# Altium project DH_7LED_LeMinhThu.PrjPcb
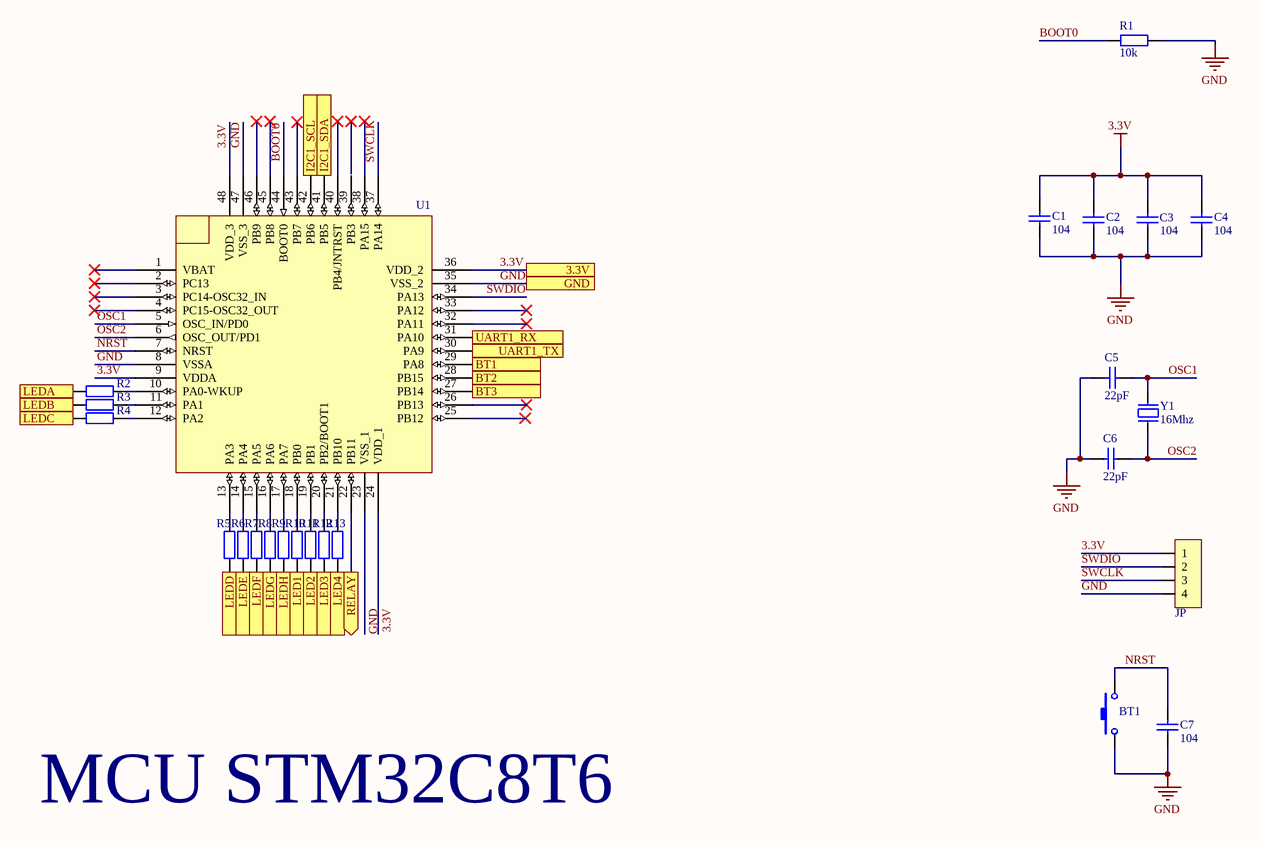
[diagram p0: SCH_DH_7LED.SchDoc]
10 sheets, 75 parts. Net scope: flat (ports and power ports of the same name join across sheets).
Board file: PCB_DH_7LED.PcbDoc
Sheets:
  SCH_DH_7LED.SchDoc
  SCH_LED_7_SEG.SchDoc
  SCH_DS3231.SchDoc
  SCH_BUTTON.SchDoc
  SCH_RELAY.SchDoc
  SCH_IR.SchDoc
  SCH_ESP8266.SchDoc
  SCH_POWER.SchDoc
  SCH_SPEAKER.SchDoc
  SCH_DHT11.SchDoc

## Sheet SCH_DH_7LED.SchDoc
size A3; SheetNumber: 1; SheetTotal: 10

### Parts
BT1  Nut Nhan 2 Chan SMD 3x6x2.5  [Nut Nhan 2 Chan SMD 3x6x2.5]  (value not drawn)
C1  104  [tu 0805]
C2  104  [tu 0805]
C3  104  [tu 0805]
C4  104  [tu 0805]
C5  22pF  [tu 0805]
C6  22pF  [tu 0805]
C7  104  [tu 0805]
JP1  JP  [JP 1x4 DT]
R1  10k  [tro smd 0805]
R2  (no value)  [tro smd 0603]
R3  (no value)  [tro smd 0603]
R4  (no value)  [tro smd 0603]
R5  (no value)  [tro smd 0603]
R6  (no value)  [tro smd 0603]
R7  (no value)  [tro smd 0603]
R8  (no value)  [tro smd 0603]
R9  (no value)  [tro smd 0603]
R10  (no value)  [tro smd 0603]
R11  (no value)  [tro smd 0603]
R12  (no value)  [tro smd 0603]
R13  (no value)  [tro smd 0603]
U1  (no value)  [STM32_LQPF48]
Y1  16Mhz  [Thach Anh 2 chan SMD]

### Ports
3.3V, BT1 (in), BT2 (in), BT3 (in), GND, I2C1_SCL, I2C1_SDA, LED1 (out), LED2 (out), LED3 (out), LED4 (out), LEDA (out), LEDB (out), LEDC (out), LEDD (out), LEDE (out), LEDF (out), LEDG (out), LEDH (out), RELAY (out), UART1_RX, UART1_TX

### Nets
3.3V: C1.1 C2.1 C3.1 C4.1 JP1.1 U1.9(VDDA) U1.24(VDD_1) U1.36(VDD_2) U1.48(VDD_3) ; port 3.3V
GND: BT1.1 C1.2 C2.2 C3.2 C4.2 C5.2 C6.1 C7.2 JP1.4 R1.1 U1.8(VSSA) U1.23(VSS_1) U1.35(VSS_2) U1.47(VSS_3) ; port GND
BOOT0: R1.2 U1.44(BOOT0)
LEDA: R2.2 ; port LEDA
LEDB: R3.2 ; port LEDB
LEDC: R4.2 ; port LEDC
LEDD: R5.1 ; port LEDD
LEDE: R6.1 ; port LEDE
LEDF: R7.1 ; port LEDF
LEDG: R8.1 ; port LEDG
LEDH: R9.1 ; port LEDH
NRST: BT1.2 C7.1 U1.7(NRST)
OSC1: C5.1 U1.5(OSC_IN/PD0) Y1.2
OSC2: C6.2 U1.6(OSC_OUT/PD1) Y1.1
SWCLK: JP1.3 U1.37(PA14)
SWDIO: JP1.2 U1.34(PA13)
NetBT3_1: U1.29(PA8) ; port BT1
NetBT4_1: U1.28(PB15) ; port BT2
NetBT5_1: U1.27(PB14) ; port BT3
NetMD1_1: U1.30(PA9) ; port UART1_TX
NetMD1_8: U1.31(PA10) ; port UART1_RX
NetR2_1: R2.1 U1.10(PA0-WKUP)
NetR3_1: R3.1 U1.11(PA1)
NetR4_1: R4.1 U1.12(PA2)
NetR5_2: R5.2 U1.13(PA3)
NetR6_2: R6.2 U1.14(PA4)
NetR7_2: R7.2 U1.15(PA5)
NetR8_2: R8.2 U1.16(PA6)
NetR9_2: R9.2 U1.17(PA7)
NetR10_1: R10.1 ; port LED1
NetR10_2: R10.2 U1.18(PB0)
NetR11_1: R11.1 ; port LED2
NetR11_2: R11.2 U1.19(PB1)
NetR12_1: R12.1 ; port LED3
NetR12_2: R12.2 U1.20(PB2/BOOT1)
NetR13_1: R13.1 ; port LED4
NetR13_2: R13.2 U1.21(PB10)
NetR20_2: U1.42(PB6) ; port I2C1_SCL
NetR21_1: U1.41(PB5) ; port I2C1_SDA
NetR25_1: U1.22(PB11) ; port RELAY

Not connected (* = marked no-connect by the designer): U1 1(VBAT)* 2(PC13)* 3(PC14-OSC32_IN)* 4(PC15-OSC32_OUT)* 25(PB12)* 26(PB13)* 32(PA11)* 33(PA12)* 38(PA15)* 39(PB3) 40(PB4/JNTRST)* 43(PB7)* 45(PB8)* 46(PB9)*

### Notes on the sheet
- MCU STM32C8T6

### Library data of the parts
BT1 = Nut Nhan 2 Chan SMD 3x6x2.5: Ma_Hang: MH001036; Ten: Nút Nhấn 2 Chân 3x6x2.5MM SMD
C1-C4 C7 = Tu 0805 104 50V 10%: Dán; Don_Vi: Con; So_Chan: 2; Ten_Linh_Kien: Tụ 0805 104-100nF 10% 50V; Ma_Hang: MH004551; Chung_Loai: Dán; Kieu_Chan: *
C5 C6 = Tu 0805 22pF 50V 10%: Dán; Don_Vi: Con; So_Chan: 2; Ten_Linh_Kien: Tụ 0805 22P 10% 50V; Ma_Hang: MH004560; Chung_Loai: Dán; Kieu_Chan: *
JP1 = JP 1x4 2.54 Duc Thang: Cắm; Ten_Linh_Kien: Jump Đơn Đực 2.54MM 1x40P Thẳng 11MM; Don_Vi: Con; Ma_Hang: MH000903; Ghi_Chu: *; Kieu_Chan: *; Chung_Loai: Cắm
R1 = Tro 0805 5% 10k: Dán; Don_Vi: Con; So_Chan: 2; Ten_Linh_Kien: Trở 0805 5% 10k; Ma_Hang: MH005239; Chung_Loai: Dán; Kieu_Chan: *
R2-R13 = Tro 0603 5% 100R: Dán; Don_Vi: Con; So_Chan: 2; Ten_Linh_Kien: Trở 0603 5% 100R; Ma_Hang: MH006315; Chung_Loai: Dán; Kieu_Chan: *
U1 = STM32F103xx_LQFP48: Published: 30-May-2008; DatasheetVersion: rev6, Mar-2008; PackageVersion: Mar-2008; PackageReference: LQFP48; Publisher: Altium Limited; PackageDescription: 48-Pin Low-Profile Quad Flat Pack, 7 x 7 mm Body, 0.5 mm Pitch (LQFP48); ComponentLink1Description: Manufacturer Link; ComponentLink1URL: www.st.com/stm32; ComponentLink2Description: Datasheet; ComponentLink2URL: http://www.st.com/stonline/products/literature/ds/13587.pdf
Y1 = Thach Anh 2 chan SMD: Crystal For all Crystal 2pin.; Value: 4Mhz

## Sheet SCH_LED_7_SEG.SchDoc
size A3; SheetNumber: 2; SheetTotal: 10
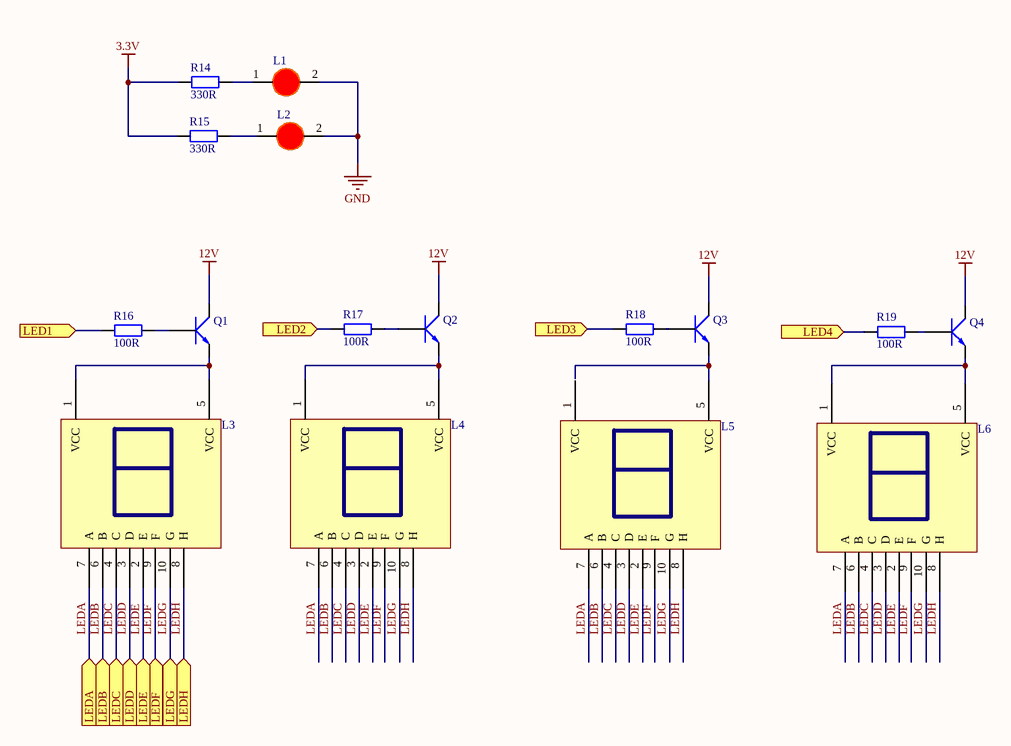
[diagram p1: SCH_LED_7_SEG.SchDoc]

### Parts
L1  (no value)  [LED-3MM-RED]
L2  (no value)  [LED-3MM-RED]
L3  (no value)  [LED7SEG_2.3inch]
L4  (no value)  [LED7SEG_2.3inch]
L5  (no value)  [LED7SEG_2.3inch]
L6  (no value)  [LED7SEG_2.3inch]
Q1  (no value)  [SOT23]
Q2  (no value)  [SOT23]
Q3  (no value)  [SOT23]
Q4  (no value)  [SOT23]
R14  330R  [tro smd 0603]
R15  330R  [tro smd 0603]
R16  100R  [tro smd 0805]
R17  100R  [tro smd 0805]
R18  100R  [tro smd 0805]
R19  100R  [tro smd 0805]

### Ports
LED1 (in), LED2 (in), LED3 (in), LED4 (in), LEDA (in), LEDB (in), LEDC (in), LEDD (in), LEDE (in), LEDF (in), LEDG (in), LEDH (in)

### Nets
3.3V: R14.1 R15.1
12V: Q1.3(C) Q2.3(C) Q3.3(C) Q4.3(C)
GND: L1.2(K) L2.2(K)
LEDA: L3.7(A) L4.7(A) L5.7(A) L6.7(A) ; port LEDA
LEDB: L3.6(B) L4.6(B) L5.6(B) L6.6(B) ; port LEDB
LEDC: L3.4(C) L4.4(C) L5.4(C) L6.4(C) ; port LEDC
LEDD: L3.3(D) L4.3(D) L5.3(D) L6.3(D) ; port LEDD
LEDE: L3.2(E) L4.2(E) L5.2(E) L6.2(E) ; port LEDE
LEDF: L3.9(F) L4.9(F) L5.9(F) L6.9(F) ; port LEDF
LEDG: L3.10(G) L4.10(G) L5.10(G) L6.10(G) ; port LEDG
LEDH: L3.8(H) L4.8(H) L5.8(H) L6.8(H) ; port LEDH
NetL1_1: L1.1(A) R14.2
NetL2_1: L2.1(A) R15.2
NetL3_1: L3.1(VCC) L3.5(VCC) Q1.2(E)
NetL4_1: L4.1(VCC) L4.5(VCC) Q2.2(E)
NetL5_5: L5.5(VCC) Q3.2(E)
NetL6_1: L6.1(VCC) L6.5(VCC) Q4.2(E)
NetQ1_1: Q1.1(B) R16.2
NetQ2_1: Q2.1(B) R17.2
NetQ3_1: Q3.1(B) R18.2
NetQ4_1: Q4.1(B) R19.2
NetR10_1: R16.1 ; port LED1
NetR11_1: R17.1 ; port LED2
NetR12_1: R18.1 ; port LED3
NetR13_1: R19.1 ; port LED4

Not connected (* = marked no-connect by the designer): L5 1(VCC)

### Library data of the parts
L1 L2 = LED 3mm Do: Cắm; Don_Vi: Con; Ma_Hang: MH003892; Ten_Linh_Kien: Led 3MM Phủ Đỏ (10c); Ghi_Chu: *; Kieu_Chan: *; Chung_Loai: Cắm
L3-L6 = LED 7x1 2.3inch Anot: Dán; Don_Vi: Con; Ma_Hang: MH000901; Ten_Linh_Kien: Led 7 2.3 1 Số Anot (Sáng Đỏ); Ghi_Chu: *; Kieu_Chan: *; Chung_Loai: Dán
Q1-Q4 = C1815 HF SMD: NPN transistor; Value: C9014
R14 R15 = Tro 0603 5% 330R: Dán; Don_Vi: Con; Ma_Hang: MH006910; So_Chan: 2; Ten_Linh_Kien: Trở 0603 5% 330R; Chung_Loai: Dán; Kieu_Chan: *
R16-R19 = Tro 0805 5% 100R: Dán; Don_Vi: Con; So_Chan: 2; Ten_Linh_Kien: Trở 0805 5% 100R; Ma_Hang: MH005251; Chung_Loai: Dán; Kieu_Chan: *

## Sheet SCH_DS3231.SchDoc
size A3; SheetNumber: 3; SheetTotal: 10
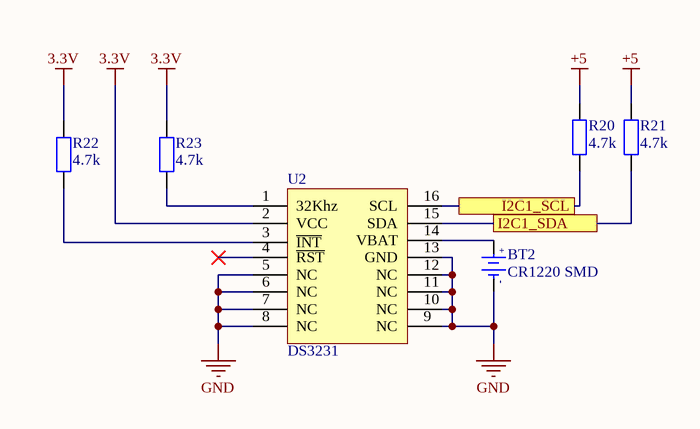
[diagram p2: SCH_DS3231.SchDoc]

### Parts
BT2  CR1220 SMD  [DE PIN CR1220]
R20  4.7k  [tro smd 0805]
R21  4.7k  [tro smd 0805]
R22  4.7k  [tro smd 0805]
R23  4.7k  [tro smd 0805]
U2  DS3231  [SOIC 16]

### Ports
I2C1_SCL, I2C1_SDA

### Nets
3.3V: R22.1 R23.2 U2.2(VCC)
+5: R20.1 R21.2
GND: BT2.2(GND) U2.5(NC) U2.6(NC) U2.7(NC) U2.8(NC) U2.9(NC) U2.10(NC) U2.11(NC) U2.12(NC) U2.13(GND)
NetBT2_1: BT2.1(+3V) U2.14(VBAT)
NetR20_2: R20.2 U2.16(SCL) ; port I2C1_SCL
NetR21_1: R21.1 U2.15(SDA) ; port I2C1_SDA
NetR22_2: R22.2 U2.3(~{INT})
NetR23_1: R23.1 U2.1(32Khz)

Not connected (* = marked no-connect by the designer): U2 4(~{RST})*

### Notes on the sheet
- (in symbol De pin CR1220 SMD) +; -

### Library data of the parts
BT2 = De pin CR1220 SMD: Ten: Đế PIN CR1220 SMD; Ma_Hang: MH000833
R20-R23 = Tro 0805 5% 4.7k: Dán; Don_Vi: Con; So_Chan: 2; Ten_Linh_Kien: Trở 0805 5% 4.7k; Ma_Hang: MH005307; Chung_Loai: Dán; Kieu_Chan: *
U2 = DS3231 SMD: SOIC

## Sheet SCH_BUTTON.SchDoc
size A3; SheetNumber: 4; SheetTotal: 10
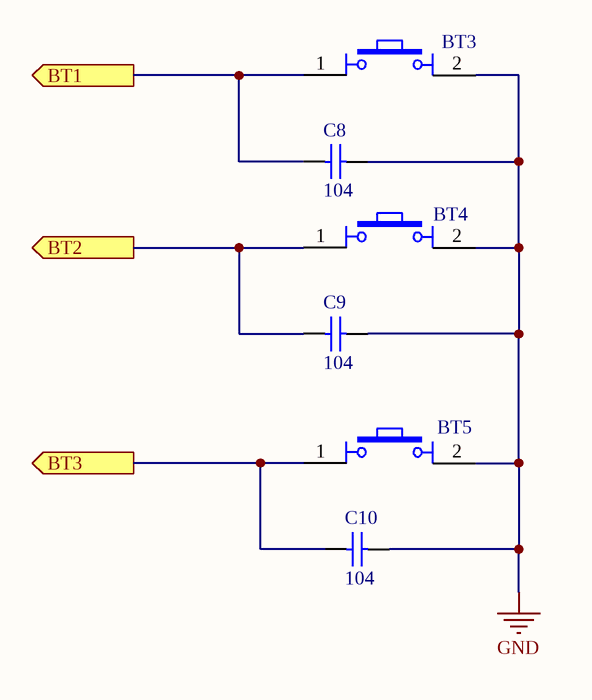
[diagram p3: SCH_BUTTON.SchDoc]

### Parts
BT3  (no value)  [Nut Nhan 4 Chan Cam 6x6]
BT4  (no value)  [Nut Nhan 4 Chan Cam 6x6]
BT5  (no value)  [Nut Nhan 4 Chan Cam 6x6]
C8  104  [tu 0805]
C9  104  [tu 0805]
C10  104  [tu 0805]

### Ports
BT1 (out), BT2 (out), BT3 (out)

### Nets
GND: BT3.2 BT4.2 BT5.2 C8.2 C9.2 C10.2
NetBT3_1: BT3.1 C8.1 ; port BT1
NetBT4_1: BT4.1 C9.1 ; port BT2
NetBT5_1: BT5.1 C10.1 ; port BT3

### Library data of the parts
BT3-BT5 = Nut Nhan 4 Chan Cam 6x6: Nut Nhan 4 Chan 6x6mm; Ten: Nút Nhấn 4 Chân 6x6x5MM DIP; Ma_Hang: MH004584
C8-C10 = Tu 0805 104 50V 10%: as C1 on sheet SCH_DH_7LED; Chung_Loai: Dán; Kieu_Chan: *

## Sheet SCH_RELAY.SchDoc
size A3; SheetNumber: 5; SheetTotal: 10
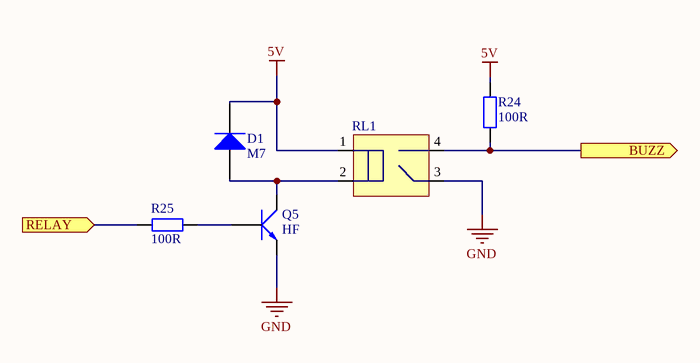
[diagram p4: SCH_RELAY.SchDoc]

### Parts
D1  M7  [DIODE SMA]
Q5  HF  [SOT23]
R24  100R  [tro smd 0603]
R25  100R  [tro smd 0805]
RL1  (no value)  [Relay 4 chan HF46F]

### Ports
BUZZ (out), RELAY (in)

### Nets
5V: D1.2(K) R24.2 RL1.1
GND: Q5.2(E) RL1.3(AC/DC)
NetD1_1: D1.1(A) Q5.3(C) RL1.2
NetQ5_1: Q5.1(B) R25.2
NetR24_1: R24.1 RL1.4(AC/DC) ; port BUZZ
NetR25_1: R25.1 ; port RELAY

### Library data of the parts
D1 = Diode M7 ( 4007 ): Dán; Don_Vi: Con; Ten_Linh_Kien: Diode M7 1N4007 SMD 1A 1000V; Ma_Hang: MH000944; Chung_Loai: Dán; Ghi_Chu: *
Q5 = C1815 HF SMD: NPN transistor; Value: C9014
R24 = Tro 0603 5% 100R: as R2 on sheet SCH_DH_7LED; Chung_Loai: Dán; Kieu_Chan: *
R25 = Tro 0805 5% 100R: as R16 on sheet SCH_LED_7_SEG; Chung_Loai: Dán; Kieu_Chan: *
RL1 = Relay 4 chan HF46F: Ten: Relay 5V5A HF46F-G 5-HS1; Ma_Hang: MH003879

## Sheet SCH_IR.SchDoc
size A3; SheetNumber: 6; SheetTotal: 10
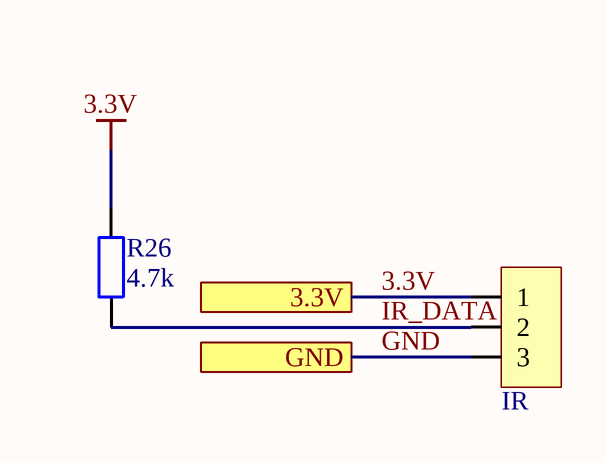
[diagram p5: SCH_IR.SchDoc]

### Parts
JP2  IR  [JP 1x3 CT]
R26  4.7k  [tro smd 0805]

### Ports
3.3V, GND

### Nets
3.3V: JP2.1 R26.2 ; port 3.3V
GND: JP2.3 ; port GND
IR_DATA: JP2.2 R26.1

### Library data of the parts
JP2 = JP 1x3 2.54 Cai Thang: Cắm; Ten_Linh_Kien: Jump Đơn Cái 2.54MM 1x20P Thẳng; Don_Vi: Con; Ma_Hang: MH004006; Ghi_Chu: *; Kieu_Chan: *; Chung_Loai: Cắm
R26 = Tro 0805 5% 4.7k: as R20 on sheet SCH_DS3231; Chung_Loai: Dán; Kieu_Chan: *

## Sheet SCH_ESP8266.SchDoc
size A3; SheetNumber: 7; SheetTotal: 10
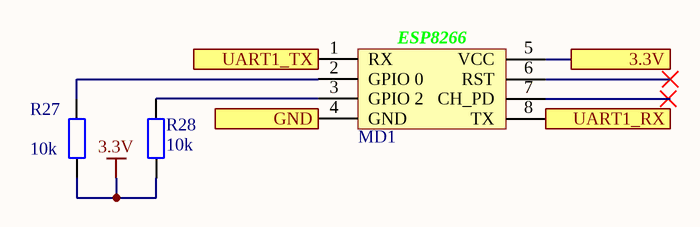
[diagram p6: SCH_ESP8266.SchDoc]

### Parts
MD1  ESP8266 Module  [ESP2866 Module]  (value not drawn)
R27  10k  [tro smd 0805]
R28  10k  [tro smd 0805]

### Ports
3.3V, GND, UART1_RX, UART1_TX

### Nets
3.3V: MD1.5(VCC) R27.1 R28.1 ; port 3.3V
GND: MD1.4(GND) ; port GND
NetMD1_1: MD1.1(RX) ; port UART1_TX
NetMD1_2: MD1.2(GPIO_0) R27.2
NetMD1_3: MD1.3(GPIO_2) R28.2
NetMD1_8: MD1.8(TX) ; port UART1_RX

Not connected (* = marked no-connect by the designer): MD1 6(RST)* 7(CH_PD)*

### Notes on the sheet
- (in symbol ESP8266 Module) ESP8266

### Library data of the parts
R27 R28 = Tro 0805 5% 10k: as R1 on sheet SCH_DH_7LED; Chung_Loai: Dán; Kieu_Chan: *

## Sheet SCH_POWER.SchDoc
size A3; SheetNumber: 8; SheetTotal: 10
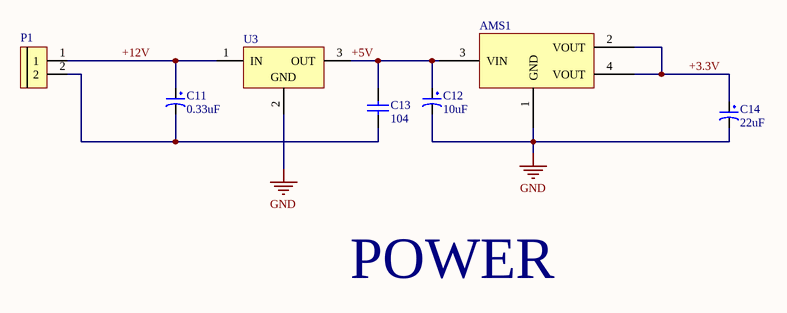
[diagram p7: SCH_POWER.SchDoc]

### Parts
AMS1  (no value)  [SOT223]
C11  0.33uF  [tu hoa 5mm]
C12  10uF  [tu hoa 13mm]
C13  104  [tu 1206]
C14  22uF  [tu hoa 4mm]
P1  (no value)  [CON 2 2EDG5.08]
U3  (no value)  [TO252]

### Nets
GND: AMS1.1(GND) C12.2 C14.2 U3.2(GND)
+3.3V: AMS1.2(VOUT) AMS1.4(VOUT) C14.1
+5V: AMS1.3(VIN) C12.1 C13.1 U3.3(OUT)
+12V: C11.1 P1.1 U3.1(IN)
NetC11_2: C11.2 C13.2 P1.2

### Notes on the sheet
- POWER

### Library data of the parts
AMS1 = AMS1117 SMD: Dán; Value: AMS1117-3.3V SOT223; Don_Vi: Con; Ma_Hang: MH000596; Ghi_Chu: *; Kieu_Chan: *; Chung_Loai: Dán
C11 = Tu Hoa 0.33uF 50V 5x11: Cắm; Don_Vi: Con; So_Chan: 2; Ten_Linh_Kien: Tụ Hóa 0.33uF 50V 5x11MM; Ma_Hang: MH004655; Chung_Loai: Cắm; Kieu_Chan: *
C12 = Tu Hoa 10uF 450V 13x20: Cắm; Don_Vi: Con; So_Chan: 2; Ten_Linh_Kien: Tụ Hóa 10uF 450V 13x20MM; Ma_Hang: MH003950; Chung_Loai: Cắm; Kieu_Chan: *
C13 = Tu 1206 104 50V 20%: Dán; Don_Vi: Con; So_Chan: 2; Ten_Linh_Kien: Tụ 1206 104-0.1uF 20% 50V; Ma_Hang: MH004544; Chung_Loai: Dán; Kieu_Chan: *
C14 = Tu Hoa 22uF 16V 4x7: Cắm; Don_Vi: Con; So_Chan: 2; Ten_Linh_Kien: Tụ Hóa 22uF 16V; Ma_Hang: MH006857; Chung_Loai: Cắm; Kieu_Chan: *
P1 = CON 2 EDG5.08: Cắm; Ten_Linh_Kien: CON 2 2EDG5.08-2P 5.08MM ( Xanh Cong); Don_Vi: Con; Ma_Hang: MH000759; Ghi_Chu: *; Kieu_Chan: *; Chung_Loai: Cắm
U3 = 78M05 SMD TO252: Dán; Don_Vi: Con; Ten_Linh_Kien: 78M05 TO252; Ma_Hang: MH001917; Ghi_Chu: *; Kieu_Chan: *; Chung_Loai: Dán

## Sheet SCH_SPEAKER.SchDoc
size A3; SheetNumber: 9; SheetTotal: 10
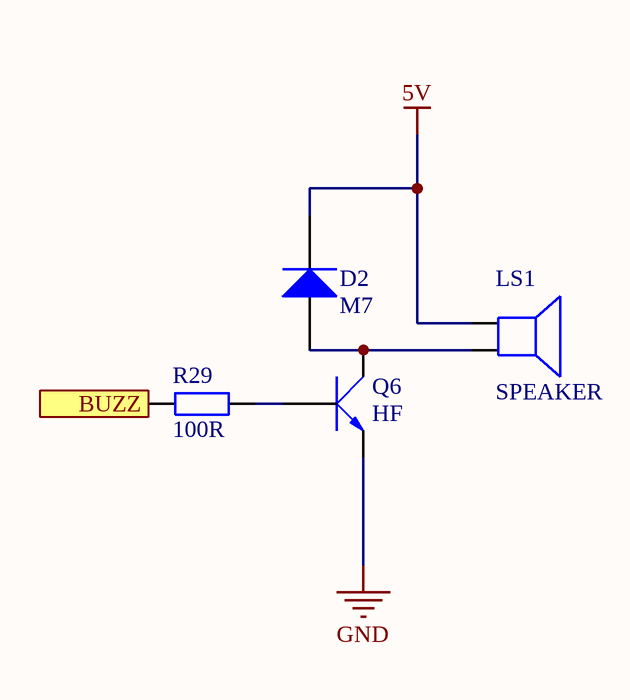
[diagram p8: SCH_SPEAKER.SchDoc]

### Parts
D2  M7  [DIODE SMA]
LS1  SPEAKER  [Coi Chip Speacker]
Q6  HF  [SOT23]
R29  100R  [tro smd 0805]

### Ports
BUZZ (in)

### Nets
5V: D2.2(K) LS1.1
GND: Q6.2(E)
NetD2_1: D2.1(A) LS1.2 Q6.3(C)
NetQ6_1: Q6.1(B) R29.2
NetR24_1: R29.1 ; port BUZZ

### Library data of the parts
D2 = Diode M7 ( 4007 ): as D1 on sheet SCH_RELAY; Chung_Loai: Dán; Ghi_Chu: *
LS1 = Coi Chip Speaker: Còi chip
Q6 = C1815 HF SMD: NPN transistor; Value: C9014
R29 = Tro 0805 5% 100R: as R16 on sheet SCH_LED_7_SEG; Chung_Loai: Dán; Kieu_Chan: *

## Sheet SCH_DHT11.SchDoc
size A3; SheetNumber: 10; SheetTotal: 10
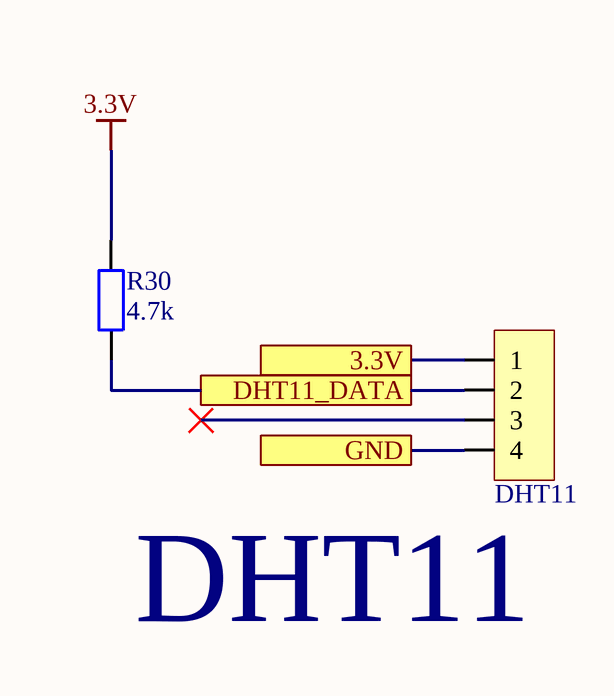
[diagram p9: SCH_DHT11.SchDoc]

### Parts
JP3  DHT11  [JP 1x4 CT]
R30  4.7k  [tro smd 0805]

### Ports
3.3V, DHT11_DATA, GND

### Nets
3.3V: JP3.1 R30.2 ; port 3.3V
GND: JP3.4 ; port GND
NetJP3_2: JP3.2 R30.1 ; port DHT11_DATA

Not connected (* = marked no-connect by the designer): JP3 3*

### Notes on the sheet
- (near JP3) DHT11

### Library data of the parts
JP3 = JP 1x4 2.54 Cai Thang: Cắm; Ten_Linh_Kien: Jump Đơn Cái 2.54MM 1x20P Thẳng; Don_Vi: Con; Ma_Hang: MH004006; Ghi_Chu: *; Kieu_Chan: *; Chung_Loai: Cắm
R30 = Tro 0805 5% 4.7k: as R20 on sheet SCH_DS3231; Chung_Loai: Dán; Kieu_Chan: *

## Nets that join several sheets
3.3V: SCH_DH_7LED (9 pins), SCH_LED_7_SEG (R14.1 R15.1), SCH_DS3231 (R22.1 R23.2 U2.2), SCH_IR (JP2.1 R26.2), SCH_ESP8266 (MD1.5 R27.1 R28.1), SCH_DHT11 (JP3.1 R30.2)
5V: SCH_RELAY (D1.2 R24.2 RL1.1), SCH_SPEAKER (D2.2 LS1.1)
GND: SCH_DH_7LED (14 pins), SCH_LED_7_SEG (L1.2 L2.2), SCH_DS3231 (10 pins), SCH_BUTTON (6 pins), SCH_RELAY (Q5.2 RL1.3), SCH_IR (JP2.3), SCH_ESP8266 (MD1.4), SCH_POWER (AMS1.1 C12.2 C14.2 U3.2), SCH_SPEAKER (Q6.2), SCH_DHT11 (JP3.4)
LEDA: SCH_DH_7LED (R2.2), SCH_LED_7_SEG (L3.7 L4.7 L5.7 L6.7)
LEDB: SCH_DH_7LED (R3.2), SCH_LED_7_SEG (L3.6 L4.6 L5.6 L6.6)
LEDC: SCH_DH_7LED (R4.2), SCH_LED_7_SEG (L3.4 L4.4 L5.4 L6.4)
LEDD: SCH_DH_7LED (R5.1), SCH_LED_7_SEG (L3.3 L4.3 L5.3 L6.3)
LEDE: SCH_DH_7LED (R6.1), SCH_LED_7_SEG (L3.2 L4.2 L5.2 L6.2)
LEDF: SCH_DH_7LED (R7.1), SCH_LED_7_SEG (L3.9 L4.9 L5.9 L6.9)
LEDG: SCH_DH_7LED (R8.1), SCH_LED_7_SEG (L3.10 L4.10 L5.10 L6.10)
LEDH: SCH_DH_7LED (R9.1), SCH_LED_7_SEG (L3.8 L4.8 L5.8 L6.8)
NetBT3_1: SCH_DH_7LED (U1.29), SCH_BUTTON (BT3.1 C8.1)
NetBT4_1: SCH_DH_7LED (U1.28), SCH_BUTTON (BT4.1 C9.1)
NetBT5_1: SCH_DH_7LED (U1.27), SCH_BUTTON (BT5.1 C10.1)
NetMD1_1: SCH_DH_7LED (U1.30), SCH_ESP8266 (MD1.1)
NetMD1_8: SCH_DH_7LED (U1.31), SCH_ESP8266 (MD1.8)
NetR10_1: SCH_DH_7LED (R10.1), SCH_LED_7_SEG (R16.1)
NetR11_1: SCH_DH_7LED (R11.1), SCH_LED_7_SEG (R17.1)
NetR12_1: SCH_DH_7LED (R12.1), SCH_LED_7_SEG (R18.1)
NetR13_1: SCH_DH_7LED (R13.1), SCH_LED_7_SEG (R19.1)
NetR20_2: SCH_DH_7LED (U1.42), SCH_DS3231 (R20.2 U2.16)
NetR21_1: SCH_DH_7LED (U1.41), SCH_DS3231 (R21.1 U2.15)
NetR24_1: SCH_RELAY (R24.1 RL1.4), SCH_SPEAKER (R29.1)
NetR25_1: SCH_DH_7LED (U1.22), SCH_RELAY (R25.1)